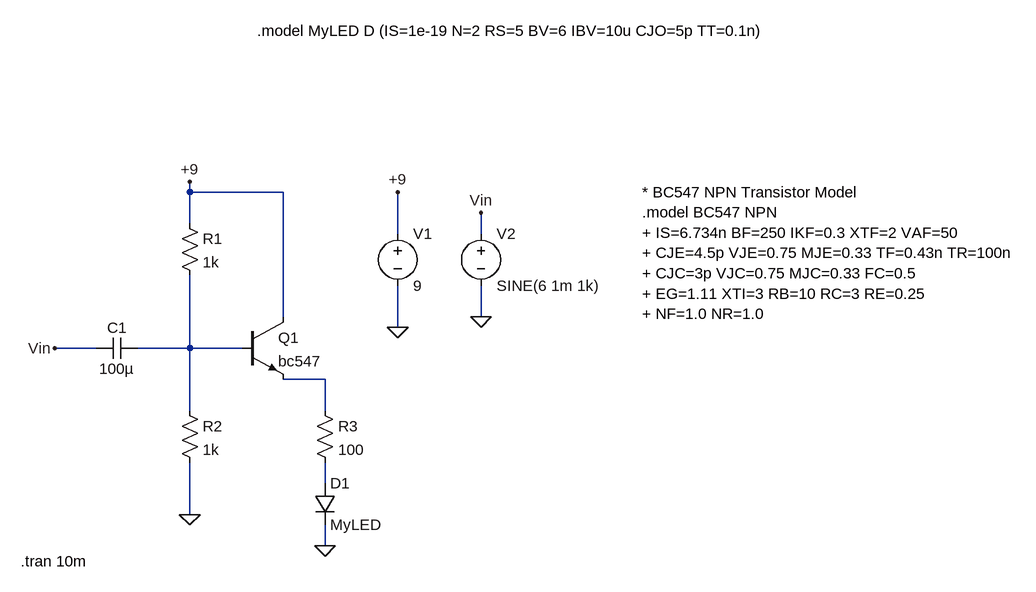
[diagram p0: schematic Draft67.asc]
Draft67.asc, the LTspice schematic file:
Version 4
SHEET 1 1436 680
WIRE 128 -32 128 -48
WIRE 272 -32 128 -32
WIRE 128 16 128 -32
WIRE 448 32 448 -32
WIRE 576 32 576 0
WIRE 272 160 272 -32
WIRE 576 160 576 112
WIRE 448 176 448 112
WIRE -16 208 -80 208
WIRE 128 208 128 96
WIRE 128 208 48 208
WIRE 208 208 128 208
WIRE 336 256 272 256
WIRE 128 304 128 208
WIRE 336 304 336 256
WIRE 336 416 336 384
WIRE 128 464 128 384
WIRE 336 512 336 480
FLAG 128 464 0
FLAG 336 512 0
FLAG 128 -48 +9
FLAG 448 176 0
FLAG 576 160 0
FLAG 576 0 Vin
FLAG 448 -32 +9
FLAG -80 208 Vin
SYMBOL res 112 0 R0
SYMATTR InstName R1
SYMATTR Value 1k
SYMBOL res 112 288 R0
SYMATTR InstName R2
SYMATTR Value 1k
SYMBOL res 320 288 R0
SYMATTR InstName R3
SYMATTR Value 100
SYMBOL cap 48 192 R90
WINDOW 0 0 32 VBottom 2
WINDOW 3 32 32 VTop 2
SYMATTR InstName C1
SYMATTR Value 100µ
SYMBOL npn 208 160 R0
SYMATTR InstName Q1
SYMATTR Value bc547
SYMBOL diode 320 416 R0
SYMATTR InstName D1
SYMATTR Value MyLED
SYMBOL voltage 448 16 R0
WINDOW 123 0 0 Left 0
WINDOW 39 0 0 Left 0
SYMATTR InstName V1
SYMATTR Value 9
SYMBOL voltage 576 16 R0
WINDOW 123 0 0 Left 0
WINDOW 39 0 0 Left 0
SYMATTR InstName V2
SYMATTR Value SINE(6 1m 1k)
TEXT -132 536 Left 2 !.tran 10m
TEXT 824 -32 Left 2 !* BC547 NPN Transistor Model\n.model BC547 NPN\n+ IS=6.734n BF=250 IKF=0.3 XTF=2 VAF=50\n+ CJE=4.5p VJE=0.75 MJE=0.33 TF=0.43n TR=100n\n+ CJC=3p VJC=0.75 MJC=0.33 FC=0.5\n+ EG=1.11 XTI=3 RB=10 RC=3 RE=0.25\n+ NF=1.0 NR=1.0
TEXT 232 -280 Left 2 !.model MyLED D (IS=1e-19 N=2 RS=5 BV=6 IBV=10u CJO=5p TT=0.1n)

The netlist it stands for:
* Draft67.asc
R1 +9 N001 1k
R2 N001 0 1k
R3 N002 N003 100
C1 N001 Vin 100µ
Q1 +9 N001 N002 0 bc547
D1 N003 0 MyLED
V1 +9 0 9
V2 Vin 0 SINE(6 1m 1k)
.model D D
.lib standard.dio
.model NPN NPN
.model PNP PNP
.lib standard.bjt
.tran 10m
* BC547 NPN Transistor Model
.model BC547 NPN
+ IS=6.734n BF=250 IKF=0.3 XTF=2 VAF=50
+ CJE=4.5p VJE=0.75 MJE=0.33 TF=0.43n TR=100n
+ CJC=3p VJC=0.75 MJC=0.33 FC=0.5
+ EG=1.11 XTI=3 RB=10 RC=3 RE=0.25
+ NF=1.0 NR=1.0
.model MyLED D (IS=1e-19 N=2 RS=5 BV=6 IBV=10u CJO=5p TT=0.1n)
.backanno
.end